# EAGLE design ATTAMI-Shield-sounday (EAGLE 7.1.0)
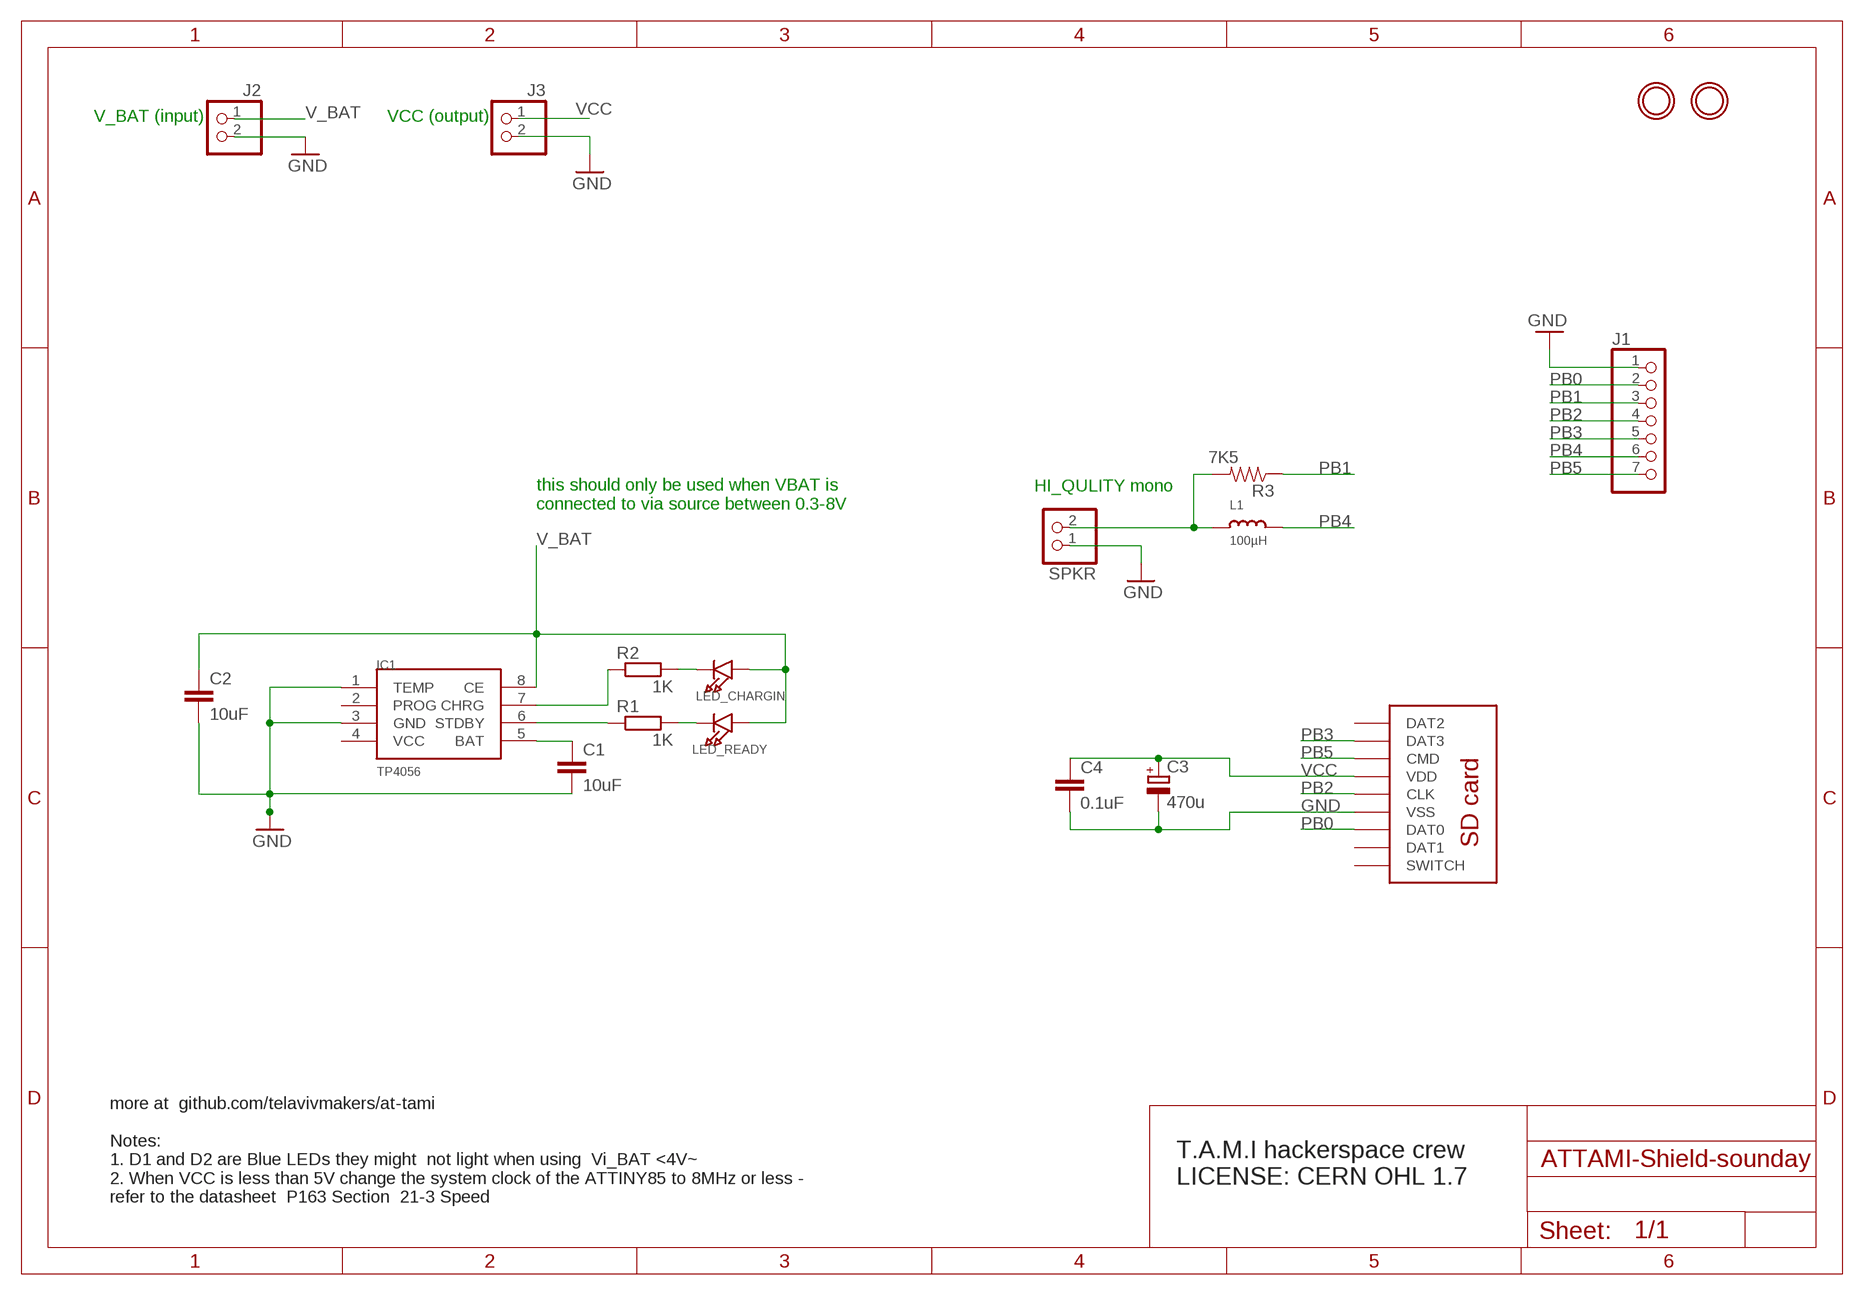
[diagram p0: schematic, sheet 1]

## Parts
C1  10uF  10UF-6.3V-20%(1206)  [1206]
C2  10uF  10UF-6.3V-20%(1206)  [1206]
C3  470u  CAPACITOR_POL-CASE_A  [CASE_A]
C4  0.1uF  0.1UF-25V(+80/-20%)(0603)  [0603-CAP]
IC1  TP4056  [SOP-8]
J1  HEADER-1X7ROUND  [1X07_ROUND]
J2  HEADER-1X2ROUND  [1X02_ROUND]
J3  HEADER-1X2ROUND  [1X02_ROUND]
L1  100µH  INDUCTOR0805  [0805]
LED_CHARGIN  LED0805_NOOUTLINE  [CHIPLED_0805_NOOUTLINE]
LED_READY  LED0805_NOOUTLINE  [CHIPLED_0805_NOOUTLINE]
R1  1K  RESISTOR-0603  [R603]
R2  1K  RESISTOR-0603  [R603]
R3  7K5  RESISTOR0805-RES  [0805]
SPKR  HEADER-1X2ROUND  [1X02_ROUND]
U$1  MOUNTINGHOLE2.0  [MOUNTINGHOLE_2.0_PLATED]
U$2  MOUNTINGHOLE2.0  [MOUNTINGHOLE_2.0_PLATED]
U$4  MOLEX-SD-105027  [MOLEX-SD-105027-PKG]

## Nets
GND: C1.2 C2.2 C3.- C4.2 IC1.1(TEMP) IC1.3(GND) J1.1 J2.2 J3.2 SPKR.1 U$4.P$6(VSS)
N$1: C1.1 IC1.5(BAT)
N$3: LED_CHARGIN.C R2.2
N$4: LED_READY.C R1.2
N$5: IC1.6(STDBY) R1.1
N$6: IC1.7(CHRG) R2.1
N$8: L1.1 R3.2 SPKR.2
PB0: J1.2 U$4.P$7(DAT0)
PB1: J1.3 R3.1
PB2: J1.4 U$4.P$5(CLK)
PB3: J1.5 U$4.P$2(DAT3)
PB4: J1.6 L1.2
PB5: J1.7 U$4.P$3(CMD)
V_BAT: C2.1 IC1.8(CE) J2.1 LED_CHARGIN.A LED_READY.A
VCC: C3.+ C4.1 J3.1 U$4.P$4(VDD)
Unconnected: IC1.2(PROG) IC1.4(VCC) U$4.G$1(SWITCH) U$4.P$1(DAT2) U$4.P$8(DAT1)

## Notes on the sheet
- V_BAT (input) | VCC (output)
- HI_QULITY mono
- this should only be used when VBAT is 
  connected to via source between 0.3-8V
- T.A.M.I hackerspace crew 
  LICENSE: CERN OHL 1.7
- more at  github.com/telavivmakers/at-tami
  
  Notes: 
  1. D1 and D2 are Blue LEDs they might  not light when using  Vi_BAT <4V~  
  2. When VCC is less than 5V change the system clock of the ATTINY85 to 8MHz or less - 
  refer to the datasheet  P163 Section  21-3 Speed

## Library data of the parts
C1 C2 = SparkFun-Capacitors:10UF-6.3V-20%(1206): Ceramic CAP-10057; PROD_ID: CAP-10057
C3 = dp_devices:CAPACITOR_POL: Polarized capacitor in various packages
C4 = SparkFun-Capacitors:0.1UF-25V(+80/-20%)(0603): Ceramic Standard decoupling cap CAP-00810; PROD_ID: CAP-00810
IC1 = TP4056:TP4056
J1 = microbuilder:HEADER-1X7: PIN HEADER
J2 J3 SPKR = microbuilder:HEADER-1X2: PIN HEADER
L1 = microbuilder:INDUCTOR: Inductors 0603: 10nH Ceramic Inductor - microwire antenna/RF (Digikey: 712-1434-2-ND) 0805: 560nH Ceramic Inductor - RF (Digikey: 553-1047-1-ND) 270nH Ceramic Inductor - Q = 40@250MHz, +-5%, 1 Ohm DC Resistance (Digikey: 535-10506-2-ND) 1007 (2518 Metric) SMT: 10µH 10% 250mOhm 820mA 1007 Inductor (Digikey: 587-2189-1-ND) 22µH 10% 500mOhm 580mA 1007 Inductor (Digikey: 587-2190-1-ND) 47µH 10% 950mOhm 420mA 1007 Inductor (Digikey: 587-2191-1-ND) 47µH 5% 100mOhm 1A 1008 Inductor (Digikey: 732-1816-1-ND) 5.0x5.0mm (Taiyo Yuden NR5040 Series) 6.8µH 20% 2.3A 64mOhm Inductor (Digikey: 587-2374-2-ND) 5.0x5.0mm (TDK VLC5045 Series) 4.7µH 20% 3.3A 34mOhm Inductor (Digikey: 445-6526-1-ND) 6.8µH 20% 2.7A 46mOhm Inductor (Digikey: 445-6527-1-ND) 6.0x6.0mm (TDK VLC6045 Series) 4.7µH 20% 3.8A 27mOhm Inductor (Digikey: 445-6538-2-ND) 6.8µH 20% 3A 41mOhm Inductor (Digikey: 445-6540-1-ND) 6.2µH 30% 2.2A 45mOhm Inductor (Digikey: SRR5028-6R2YCT-ND) - Not TDK VLC6045 but footprint should match 6.0x6.0mm (TDK SLF6045 Series) 6.8uH 30% 2A 33mOhm Inductor (Digikey: 445-4572-1-ND, Mouser: 810-SLF645T6R8N2R0PF)
LED_CHARGIN LED_READY = microbuilder:LED: LED 0603 - 0603 Surface Mount Package 2mA: Green LED - Low Power (3.9mcd, 2ma, 1.7Vf) - Digikey: 475-2709-2-ND Orange LED - Low Power (9.8mcd, 2ma, 1.8Vf) - Digikey: 475-1194-2-ND Red LED - Low Power (5mcd, 2ma, 1.8Vf) - Digikey: 475-1195-2-ND Yellow LED - Low Power (7mcd, 2ma, 1.8Vf) - Digikey: 475-1196-2-ND 5mA: Blue LED - Low Power (17mcd, 5ma, 2.9Vf) - Digikey: LNJ937W8CRACT-ND 0805 - 0805 Surface Mount Package 2mA: Red LED (8.8mcd, 2mA, 1.8Vf, Clear) - Low Power [Digikey: 475-2510-1-ND] Green LED (5mcd, 2mA, 1.8Vf, Clear) - Low Power [Digikey: 475-2730-1-ND] Yellow LED (11.3mcd, 2mA, 1.8Vf, Clear) - Low Power [Digikey: 475-2555-1-ND] 20mA: Red LED (104mcd, 20mA, Diffused) - LS R976 [Digikey: 475-1278-6-ND] Red LED (12mcd, 20mA, 2.0Vf, Clear) - APT2012EC [Digikey: 754-1128-1-ND] Green LED (15mcd, 20mA, 2.2Vf, Clear) - APT2012GC [Digikey: 754-1131-1-ND] Orange LED (160mcd, 20mA, 2.1Vf, Clear) - APT2012SECK [Digikey: 754-1130-1-ND] 1206 - 1206 Surface Mount Package Green LED (26mcd, 20mA, Diffused) - LG N971 [Digikey: 475-1407-6-ND] Red LED (15mcd, 20mA, Diffused) - LH N974 [Digikey: 475-1416-6-ND]
R1 R2 = dp_devices:RESISTOR
R3 = SparkFun-Passives:RESISTOR: Resistor Basic schematic elements and footprints for 0603, 1206, and PTH resistors.
U$1 U$2 = microbuilder:MOUNTINGHOLE: Mounting Hole For #2 screws (0.086"/2.18mm width, 0.094"/2.4mm hole) use 2.5mm
U$4 = pyboard:MOLEX-SD-105027

## Net classes
0 default: width 0.203 mm
1 vcc: width 0.254 mm

## Board
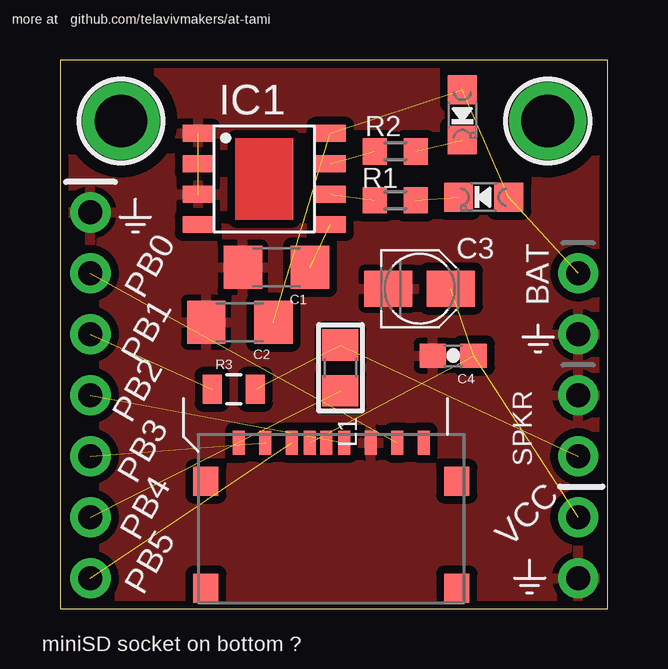
[diagram p1: board, top side]
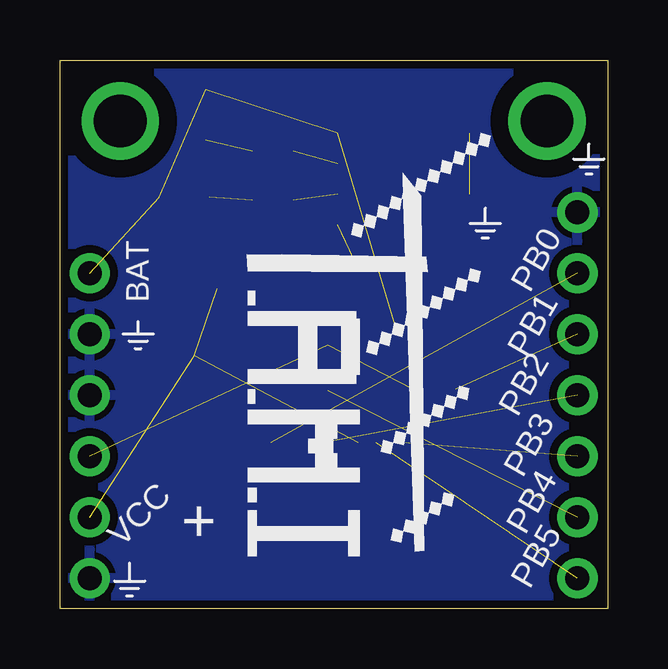
[diagram p2: board, bottom side, seen from below]

Size 22.83 x 22.86 mm. Coordinates in mm from the lower left corner, seen from the top.
Outline: 0,0 22.83,0 22.83,22.86 0,22.86 0,0
Copper layers (1*16): Top 0.035mm / dielectric 1.5mm / Bottom 0.035mm
Design rules "dirt_cheap_dirty_boards.v1": minimum track width 5mil, minimum drill 12mil, track to track 5mil, track to pad 5mil, pad to pad 5mil, via to via 5mil, smd to smd 0mil, copper to edge 10mil, drill to drill 10mil, minimum pad ring 10mil, minimum via ring 6mil, stop-mask expansion 2mil, vias tented up to drill 25mil, thermal gap 10mil

### Footprints (pad centres in the part's own frame; a part is rotated, then mirrored left to right if it is on the bottom)
1206 = smd 1.6 x 1.8: 1 -1.4,0; 2 1.4,0
CASE_A = smd 2 x 1.5: + 1.3,0; - -1.3,0
0603-CAP = smd 1.1 x 1: 1 -0.85,0; 2 0.85,0
SOP-8 = smd 1.3 x 0.7: 1 -2.75,1.905; 2 -2.75,0.635; 3 -2.75,-0.635; 4 -2.75,-1.905; 5 2.75,-1.905; 6 2.75,-0.635; 7 2.75,0.635; 8 2.75,1.905
1X07_ROUND = drill 1 pad 1.676: 1 -7.62,0; 2 -5.08,0; 3 -2.54,0; 4 0,0; 5 2.54,0; 6 5.08,0; 7 7.62,0
1X02_ROUND = drill 1 pad 1.676: 1 -1.27,0; 2 1.27,0
0805 = smd 1.3 x 1.5: 1 -0.95,0; 2 0.95,0
CHIPLED_0805_NOOUTLINE = smd 1.2 x 1.2: A 0,-1.05; C 0,1.05
R603 = smd 1 x 1.1: 1 -0.85,0; 2 0.85,0
0805' = smd 0.8 x 1.2: 1 -0.9,0; 2 0.9,0
MOUNTINGHOLE_2.0_PLATED = drill 2.2 pad 3: P$1 0,0
MOLEX-SD-105027-PKG = smd 0.5 x 1: G$1 0.2,-6.66; P$1 3.85,-6.66; P$2 2.75,-6.66; P$3 1.65,-6.66; P$4 0.9,-6.66; P$5 -0.55,-6.66; P$6 -1.65,-6.66; P$7 -2.75,-6.66; P$8 -3.85,-6.66 | smd 1.05 x 1.2: M$1 5.225,-0.6; M$2 5.225,-5.05; M$3 -5.225,-0.6; M$4 -5.225,-5.05

### Placement (x,y rotation side)
C1  9.02,14.22 180 top
C2  7.49,11.94 180 top
C3  14.99,13.34 0 top
C4  16.38,10.54 180 top
IC1  8.51,17.91 0 top
J1  1.27,8.89 270 top
J2  21.59,12.7 270 top
J3  21.59,2.54 270 top
L1  11.68,10.03 270 top
LED_CHARGIN  16.76,20.57 180 top
LED_READY  17.65,17.14 90 top
R1  13.97,17.02 0 top
R2  13.97,19.05 0 top
R3  7K5  [0805']  7.24,9.14 0 top
SPKR  21.59,7.62 270 top
U$1  2.54,20.32 270 top
U$2  20.32,20.32 0 top
U$3  [OSHW_6X150_NOTEXT]  34.04,7.75 90 top  (outside the outline)
U$4  11.3,0.25 180 top

### Tracks (layer width: path | path; a pad name or v marks a point on that pad's centre or on a via)
GND  (1 unrouted)
  pour Bottom (isolate 0.33): 23.37,23.75 -1.52,23.62 -1.21,-1.43 23.37,-1.02
  pour Top (isolate 0.33): -1.02,23.5 -1.02,-0.51 23.62,-0.51 23.3,23.53
N$1  (1 unrouted)
N$3  (1 unrouted)
N$4  (1 unrouted)
N$5  (1 unrouted)
N$6  (1 unrouted)
N$8  (2 unrouted)
PB0  (1 unrouted)
PB1  (1 unrouted)
PB2  (1 unrouted)
PB3  (1 unrouted)
PB4  (1 unrouted)
PB5  (1 unrouted)
V_BAT  (4 unrouted)
VCC  (3 unrouted)

### Text on the board
tPlace: more at github.com/telavivmakers/at-tami | miniSD socket on bottom ? | to hide the silkscreen: / disable layers: tNames, bNames, tPlace, bPlace
bPlace: BAT | PB0 | PB1 | PB2 | PB3 | PB4 | + | VCC | PB5
tNames: BAT | PB0 | PB1 | PB2 | PB3 | PB4 | VCC | PB5
tTest: J2